# Altium schematic sheet Battery Charger.SchDoc: Battery Charger
size 292 x 193 mm; SheetNumber: 4; SheetTotal: 5
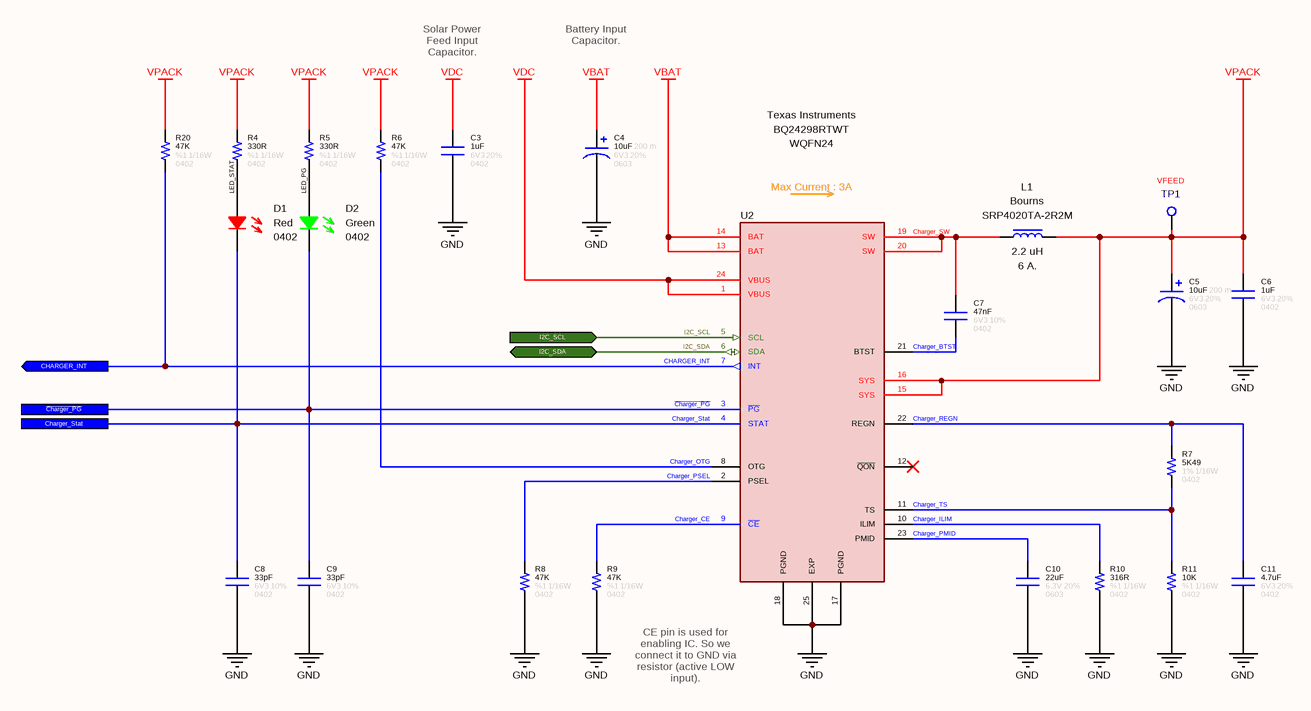
[diagram p0: Battery Charger.SchDoc]

## Parts
C3  value 1uF  Tolerance: 20%  Case: 0402  Voltage: 6V3  [CAPACITOR_0402]  (hidden comment: Capacitor - 1uF [0402] (Ceramic))
C4  value 10uF  ESR: 200 m  Tolerance: 20%  Case: 0603  Voltage: 6V3  [CAPACITOR_0603_Tantalum]  (hidden comment: Capacitor - 10uF [0603] (Tantalum))
C5  value 10uF  ESR: 200 m  Tolerance: 20%  Case: 0603  Voltage: 6V3  [CAPACITOR_0603_Tantalum]  (hidden comment: Capacitor - 10uF [0603] (Tantalum))
C6  value 1uF  Tolerance: 20%  Case: 0402  Voltage: 6V3  [CAPACITOR_0402]  (hidden comment: Capacitor - 1uF [0402] (Ceramic))
C7  value 47nF  Tolerance: 10%  Case: 0402  Voltage: 6V3  [CAPACITOR_0402]  (hidden comment: Capacitor - 47nF [0402] (Ceramic))
C8  value 33pF  Tolerance: 10%  Case: 0402  Voltage: 6V3  [CAPACITOR_0402]  (hidden comment: Capacitor - 33pF [0402] (Ceramic))
C9  value 33pF  Tolerance: 10%  Case: 0402  Voltage: 6V3  [CAPACITOR_0402]  (hidden comment: Capacitor - 33pF [0402] (Ceramic))
C10  value 22uF  Tolerance: 20%  Case: 0603  Voltage: 6.3V  [CAPACITOR_0603]  (hidden comment: Capacitor - 22uF [0603] (Ceramic))
C11  value 4.7uF  Tolerance: 20%  Case: 0402  Voltage: 6V3  [CAPACITOR_0402]  (hidden comment: Capacitor - 4.7uF [0402] (Ceramic))
D1  Case: 0402  Color: Red  [LED_0402]  (hidden comment: SMD LED (Red))
D2  Case: 0402  Color: Green  [LED_0402]  (hidden comment: SMD LED (Green))
L1  value 2.2 uH  Manufacturer Name: Bourns  Maximum DC Current: 6 A.  [SRP4020TA]  (hidden comment: SRP4020TA-2R2M)
R4  value 330R  Case: 0402  Tolerance: %1  Power: 1/16W  [RESISTOR_0402]  (hidden comment: 330R - 0402 - %1 - 1/16W)
R5  value 330R  Case: 0402  Tolerance: %1  Power: 1/16W  [RESISTOR_0402]  (hidden comment: 330R - 0402 - %1 - 1/16W)
R6  value 47K  Tolerance: %1  Case: 0402  Power: 1/16W  [RESISTOR_0402]  (hidden comment: 47K - 0402 - %1 - 1/16W)
R7  value 5K49  Power: 1/16W  Case: 0402  Tolerance: 1%  [RESISTOR_0402]  (hidden comment: 5K49 - 0402 - %1 - 1/16W)
R8  value 47K  Tolerance: %1  Case: 0402  Power: 1/16W  [RESISTOR_0402]  (hidden comment: 47K - 0402 - %1 - 1/16W)
R9  value 47K  Tolerance: %1  Case: 0402  Power: 1/16W  [RESISTOR_0402]  (hidden comment: 47K - 0402 - %1 - 1/16W)
R10  value 316R  Power: 1/16W  Case: 0402  Tolerance: %1  [RESISTOR_0402]  (hidden comment: 316R - 0402 - %1 - 1/16W)
R11  value 10K  Tolerance: %1  Case: 0402  Power: 1/16W  [RESISTOR_0402]  (hidden comment: 10K - 0402 - %1 - 1/16W)
R20  value 47K  Tolerance: %1  Case: 0402  Power: 1/16W  [RESISTOR_0402]  (hidden comment: 47K - 0402 - %1 - 1/16W)
TP1  Name: VFEED  [Test_Point]  (no BOM)
U2  Manufacturer Name: Texas Instruments  Case: WQFN24  [WQFN-24]  (hidden comment: BQ24298RTWT)

## Ports
CHARGER_INT (out), Charger_Stat, I2C_SCL (in), I2C_SDA (bidir), ~{Charger_PG}

## Nets
GND: C3.1 C4.2 C5.2 C6.1 C8.1 C9.1 C10.1 C11.1 R8.1 R9.1 R10.1 R11.1 U2.17(PGND) U2.18(PGND) U2.25(EXP)
VBAT: C4.1 U2.13(BAT) U2.14(BAT)
VDC: C3.2 U2.1(VBUS) U2.24(VBUS)
VPACK: C5.1 C6.2 L1.2 R4.2 R5.2 R6.2 R20.2 TP1.1 U2.15(SYS) U2.16(SYS)
~{Charger_PG}: C9.2 D2.1 U2.3(~{PG}) ; port ~{Charger_PG}
Charger_BTST: C7.1 U2.21(BTST)
Charger_CE: R9.2 U2.9(~{CE})
Charger_ILIM: R10.2 U2.10(ILIM)
CHARGER_INT: R20.1 U2.7(INT) ; port CHARGER_INT
Charger_OTG: R6.1 U2.8(OTG)
Charger_PMID: C10.2 U2.23(PMID)
Charger_PSEL: R8.2 U2.2(PSEL)
Charger_REGN: C11.2 R7.2 U2.22(REGN)
Charger_Stat: C8.2 D1.1 U2.4(STAT) ; port Charger_Stat
Charger_SW: C7.2 L1.1 U2.19(SW) U2.20(SW)
Charger_TS: R7.1 R11.2 U2.11(TS)
I2C_SCL: U2.5(SCL) ; port I2C_SCL
I2C_SDA: U2.6(SDA) ; port I2C_SDA
LED_PG: D2.2 R5.1
LED_STAT: D1.2 R4.1

Not connected (* = marked no-connect by the designer): U2 12(~{QON})*

## Notes on the sheet
- Solar Power Feed Input Capacitor.
- Battery Input Capacitor.
- CE pin is used for enabling IC. So we connect it to GND via resistor (active LOW input).
- © 2021 All rights reserved.
  This document may not, in whole or in part, be copied, photocopied, reproduced, translated or converted to any electronic or machine readable from without prior written permission of Mehmet Günce Akkoyun.
  Engineer contact : akkoyun@me.com
- Property of
- Engineer :
- Date :
- Size :
- A4
- Time :
- Project :
- Page :
- /
- Customer :
- Product ID :
- Module ID :
- Version :
- File :
- Revision :
- (in symbol IC - BQ24298RTWT) Max Current : 3A

## Library data of the parts
C3 C6 = Capacitor - 1uF [0402-6V3]: Multilayer Ceramic Capacitors - SMD - 6.3V 1uF X5R 0402 20%; Manufacturer Part Number: GRM153R60J105ME95D; Manufacturer Name: Murata
C4 C5 = Capacitor - 10uF [0603-6V3] (Tantalium): Capacitor - 10uF [0603] (Tantalium); Manufacturer Name: AVX; Manufacturer Part Number: F380J106MMAAH3; ComponentLink1Description: DataSheet; ComponentLink1URL: https://www.mouser.com.tr/datasheet/2/40/f38-775706.pdf; ComponentLink2Description: Mouser; ComponentLink2URL: https://www.mouser.com.tr/ProductDetail/AVX/F380J106MMAAH3?qs=sGAEpiMZZMtZ1n0r9vR22fixilZl6Mr8zRKleESmvcDFwZ4LSyC6Pg%3D%3D
C7 = Capacitor - 47nF [0402-6V3]: Multilayer Ceramic Capacitors - SMD - 6.3V 47nF X7R 0402 10%; Manufacturer Name: AVX; Manufacturer Part Number: 04026C473KAT2A
C8 C9 = Capacitor - 33pF [0402-6V3]: Manufacturer Name: Kemet; Manufacturer Part Number: C0402C330J9RACAUTO; ComponentLink1Description: DataSheet; ComponentLink1URL: https://api.kemet.com/component-edge/download/datasheet/C0402C330J9RACAUTO.pdf; ComponentLink2Description: Mouser; ComponentLink2URL: https://www.mouser.com/Search/Refine.aspx?Keyword=80-C0402C330J9RAUTO
C10 = Capacitor - 22uF [0603-6V3]: Multilayer Ceramic Capacitors - SMD - 6V3 22uF X5R 0603 20%; Manufacturer Part Number: GRM188R60J226MEA0D; Manufacturer Name: Murata
C11 = Capacitor - 4.7uF [0402-6V3]: Multilayer Ceramic Capacitors - SMD - 6V3 4.7uF X5R 0402 20%; Manufacturer Part Number: C0402C475M9PACTU; Manufacturer Name: KEMET
D1 = Diode - LED (0402-Red): Standard LEDs - SMD MINI-MOLD ULTRA COMPACT RED; Manufacturer Name: ROHM Semiconductor; Manufacturer Part Number: SML-P12VTT86R; ROHS: Yes; ComponentLink1Description: DataSheet; ComponentLink1URL: https://www.mouser.com.tr/datasheet/2/348/sml-p1-e-1139198.pdf; ComponentLink2Description: Mouser; ComponentLink2URL: https://www.mouser.com.tr/ProductDetail/ROHM-Semiconductor/SML-P12U2TT86R?qs=sGAEpiMZZMseGfSY3csMkRIBDsfU3UCXJTULB5gem9Ta%252Bp%252BvZ709fg%3D%3D
D2 = Diode - LED (0402-Green): Standard LEDs - SMD MINI-MOLD ULTRA COMPACT GREEN; Manufacturer Name: ROHM Semiconductor; Manufacturer Part Number: SML-P12MTT86R; ROHS: Yes; ComponentLink1Description: DataSheet; ComponentLink1URL: https://www.mouser.com.tr/datasheet/2/348/sml-p1-e-1139198.pdf; ComponentLink2Description: Mouser; ComponentLink2URL: https://www.mouser.com.tr/ProductDetail/ROHM-Semiconductor/SML-P12U2TT86R?qs=sGAEpiMZZMseGfSY3csMkRIBDsfU3UCXJTULB5gem9Ta%252Bp%252BvZ709fg%3D%3D
L1 = Inductor - SRP4020TA-2R2M: 6 A. 2.2uH Power inducator, 20% tol, SMD, RoHS; Maximum DC Resistance: 61 mOhms; Core Material: Carbonyl Powder; Maximum Operating Temperature: +150 C; ROHS: Yes; Tolerance: 20%; Minimum Operating Temperature: -40 C; Height: 1.8mm; Product Type: Fixed Inductors; Case: SMD; Manufacturer Part Number: SRP4020TA-2R2M
R4 R5 = Resistor - 330R [0402]: Thick Film Resistors - SMD 1/16 W 330 Ohm 1%; Manufacturer Name: Vishay; Manufacturer Part Number: CRCW0402330RFKED; ComponentLink1Description: DataSheet; ComponentLink1URL: https://www.mouser.com.tr/datasheet/2/427/dcrcwe3-1762152.pdf; ComponentLink2Description: Mouser; ComponentLink2URL: https://www.mouser.com.tr/ProductDetail/Vishay-Dale/CRCW0402330RFKED?qs=sGAEpiMZZMu61qfTUdNhG2DpbjADlD3GGS6SwBlLi5Q%3D
R6 R8 R9 R20 = Resistor - 47K [0402]: Thick Film Resistors - SMD 1/16 W 47 KOhm 1%; Manufacturer Name: Vishay; Manufacturer Part Number: CRCW040247K0FKED; ComponentLink1Description: DataSheet; ComponentLink1URL: https://www.mouser.com.tr/datasheet/2/427/dcrcwe3-1762152.pdf; ComponentLink2Description: Mouser; ComponentLink2URL: https://www.mouser.com.tr/ProductDetail/Vishay-Dale/CRCW040247K0FKED?qs=sGAEpiMZZMu61qfTUdNhG2DpbjADlD3GL%252B3h1elTxqU%3D
R7 = Resistor - 5K49 [0402]: Thick Film Resistors - SMD 1/16 W 5.49 KOhm 1%; Manufacturer Name: Vishay; Manufacturer Part Number: CRCW04025K49FKED
R10 = Resistor - 316R [0402]: Thick Film Resistors - SMD 1/16 W 316 Ohm 1%; Manufacturer Name: Vishay; Manufacturer Part Number: CRCW0402316RFKED
R11 = Resistor - 10K [0402]: Thick Film Resistors - SMD 1/16 W 10 KOhm 1%; Manufacturer Name: Vishay; Manufacturer Part Number: CRCW040210K0FKED; ComponentLink1Description: DataSheet; ComponentLink1URL: https://www.mouser.com.tr/datasheet/2/427/dcrcwe3-1762152.pdf; ComponentLink2Description: Mouser; ComponentLink2URL: https://www.mouser.com.tr/ProductDetail/Vishay-Dale/CRCW040210K0FKED?qs=sGAEpiMZZMu61qfTUdNhG2DpbjADlD3GcalbOv9utCY%3D
TP1 = Test Point
U2 = IC - BQ24298RTWT: I2C Controlled 3A Single Cell Charger; Operating Supply Current: 3 A.; Maximum Operating Temperature: +85; Minimum Operating Temperature: -40; ROHS: Yes; Product Type: Charge Management IC; Manufacturer Part Number: BQ24298RTWT